# EAGLE design Adaptadores Seriales (EAGLE 6.1)
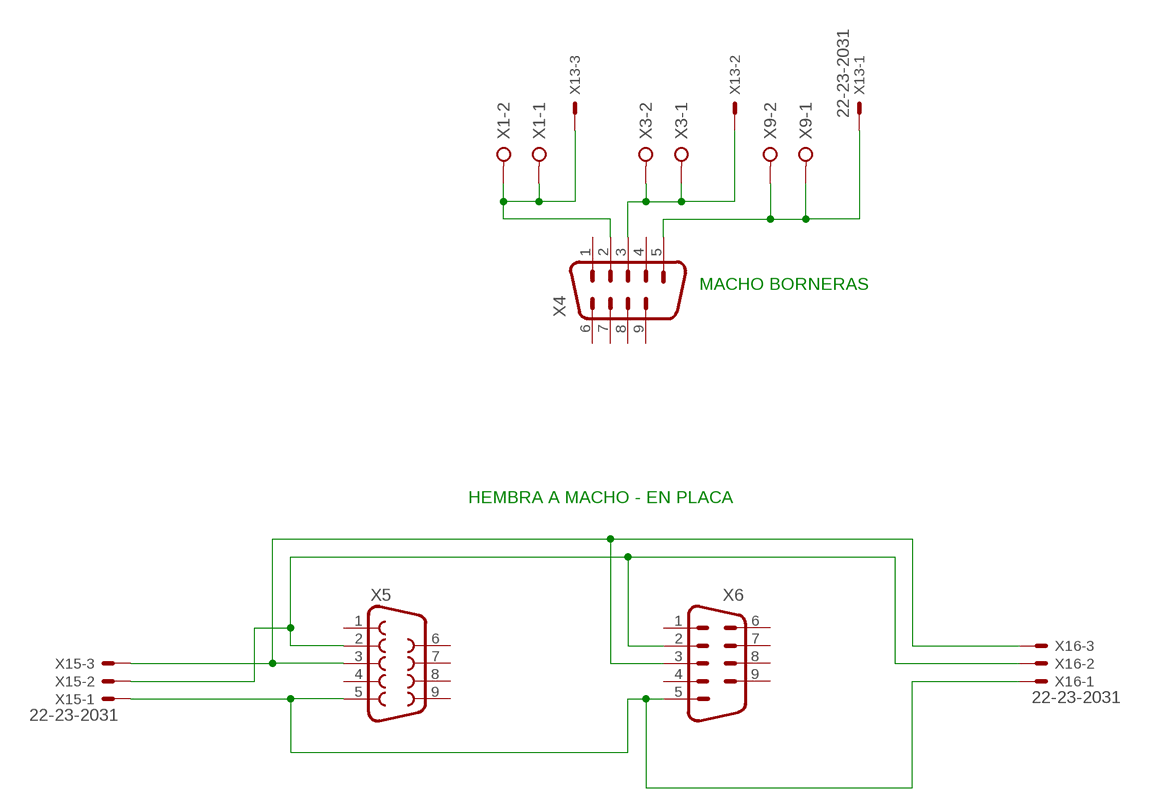
[diagram p0: schematic, sheet 1, part 1 of 2]
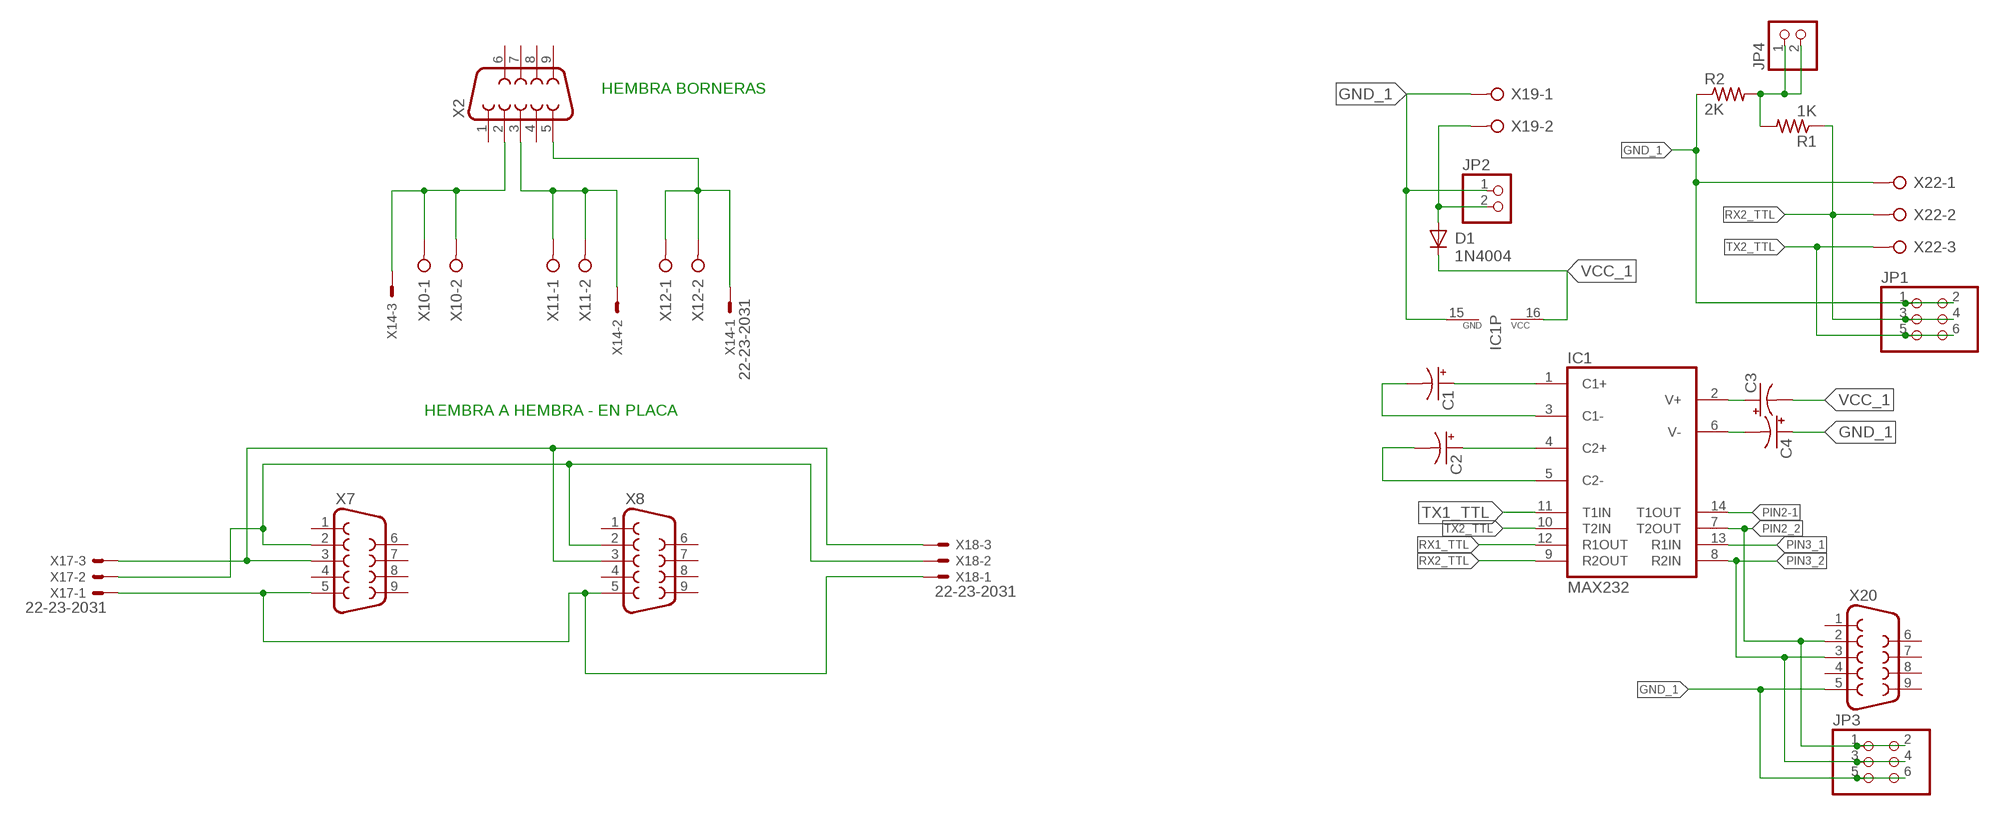
[diagram p1: schematic, sheet 1, part 2 of 2]

## Parts
C1  10UF-25V-20%(PTH)KIT  [CPOL-RADIAL-10UF-25V-KIT]
C2  10UF-25V-20%(PTH)KIT  [CPOL-RADIAL-10UF-25V-KIT]
C3  10UF-25V-20%(PTH)KIT  [CPOL-RADIAL-10UF-25V-KIT]
C4  10UF-25V-20%(PTH)KIT  [CPOL-RADIAL-10UF-25V-KIT]
D1  1N4004  [DO41-10]
IC1  MAX232  [DIL16]
JP1  PINHD-2X3  [2X03]
JP2  PINHD-1X2  [1X02]
JP3  PINHD-2X3  [2X03]
JP4  PINHD-1X2  [1X02]
R1  1K  R-US_0204/2V  [0204V]
R2  2K  R-US_0204/2V  [0204V]
X1  W237-02P  [W237-132]
X2  F09HP  [F09HP]
X3  W237-02P  [W237-132]
X4  M09HP  [M09HP]
X5  F09D  [F09D]
X6  M09D  [M09D]
X7  F09D  [F09D]
X8  F09D  [F09D]
X9  W237-02P  [W237-132]
X10  W237-02P  [W237-132]
X11  W237-02P  [W237-132]
X12  W237-02P  [W237-132]
X13  22-23-2031  [22-23-2031]
X14  22-23-2031  [22-23-2031]
X15  22-23-2031  [22-23-2031]
X16  22-23-2031  [22-23-2031]
X17  22-23-2031  [22-23-2031]
X18  22-23-2031  [22-23-2031]
X19  W237-02P  [W237-132]
X20  F09D  [F09D]
X22  W237-03P  [W237-133]

## Nets
GND_1: C4.1(+) IC1.15(GND) JP1.1 JP1.2 JP2.1 JP3.5 JP3.6 R2.1 X19.1 X20.5 X22.1
N$1: C1.1(+) IC1.1(C1+)
N$2: X5.2 X6.2 X15.2 X16.2
N$3: X5.3 X6.3 X15.3 X16.3
N$4: C1.2(-) IC1.3(C1-)
N$5: X5.5 X6.5 X15.1 X16.1
N$6: D1.A JP2.2 X19.2
N$7: C2.1(+) IC1.4(C2+)
N$8: C2.2(-) IC1.5(C2-)
N$9: C3.1(+) IC1.2(V+)
N$10: C4.2(-) IC1.6(V-)
N$11: X7.2 X8.2 X17.2 X18.2
N$12: X7.3 X8.3 X17.3 X18.3
N$13: JP4.1 JP4.2 R1.2 R2.2
N$14: X7.5 X8.5 X17.1 X18.1
N$19: X1.1 X1.2 X4.2 X13.3
N$21: X3.1 X3.2 X4.3 X13.2
N$22: X4.5 X9.1 X9.2 X13.1
N$23: X2.2 X10.1 X10.2 X14.3
N$24: X2.3 X11.1 X11.2 X14.2
N$25: X2.5 X12.1 X12.2 X14.1
PIN2-1: IC1.14(T1OUT)
PIN2_2: IC1.7(T2OUT) JP3.1 JP3.2 X20.2
PIN3_1: IC1.13(R1IN)
PIN3_2: IC1.8(R2IN) JP3.3 JP3.4 X20.3
RX1_TTL: IC1.12(R1OUT)
RX2_TTL: IC1.9(R2OUT) JP1.3 JP1.4 R1.1 X22.2
TX1_TTL: IC1.11(T1IN)
TX2_TTL: IC1.10(T2IN) JP1.5 JP1.6 X22.3
VCC_1: C3.2(-) D1.C IC1.16(VCC)
Unconnected: X2.1 X2.4 X2.6 X2.7 X2.8 X2.9 X4.1 X4.4 X4.6 X4.7 X4.8 X4.9 X5.1 X5.4 X5.6 X5.7 X5.8 X5.9 X6.1 X6.4 X6.6 X6.7 X6.8 X6.9 X7.1 X7.4 X7.6 X7.7 X7.8 X7.9 X8.1 X8.4 X8.6 X8.7 X8.8 X8.9 X20.1 X20.4 X20.6 X20.7 X20.8 X20.9

## Notes on the sheet
- HEMBRA BORNERAS
- MACHO BORNERAS
- HEMBRA A HEMBRA - EN PLACA
- HEMBRA A MACHO - EN PLACA

## Library data of the parts
C1-C4 = SparkFun-Capacitors:10UF-25V-20%(PTH): CAP-08440; PROD_ID: CAP-08440
D1 = diode:1N4004: DIODE general purpose rectifier, 1 A
IC1 = maxim:MAX232: RS232 TRANSEIVER; MF: MAXIM; MPN: MAX232ACPE+; OC_FARNELL: 9723773; OC_NEWARK: 68K4544
JP1 JP3 = pinhead:PINHD-2X3: PIN HEADER
JP2 JP4 = pinhead:PINHD-1X2: PIN HEADER
R1 R2 = rcl:R-US_: RESISTOR, American symbol
X1 X3 X9-X12 X19 = con-wago-508:W237-02P: WAGO SREW CLAMP; OC_FARNELL: unknown; OC_NEWARK: unknown
X2 X5 X7 X8 X20 = con-subd:F09: SUB-D; OC_FARNELL: unknown; OC_NEWARK: unknown
X4 X6 = con-subd:M09: SUB-D; OC_FARNELL: unknown; OC_NEWARK: unknown
X13-X18 = con-molex:22-23-2031: .100" (2.54mm) Center Header - 3 Pin; MF: MOLEX; MPN: 22-23-2031; OC_FARNELL: 1462950; OC_NEWARK: 30C0862
X22 = con-wago-508:W237-03P: WAGO SREW CLAMP; OC_FARNELL: unknown; OC_NEWARK: unknown

## Board
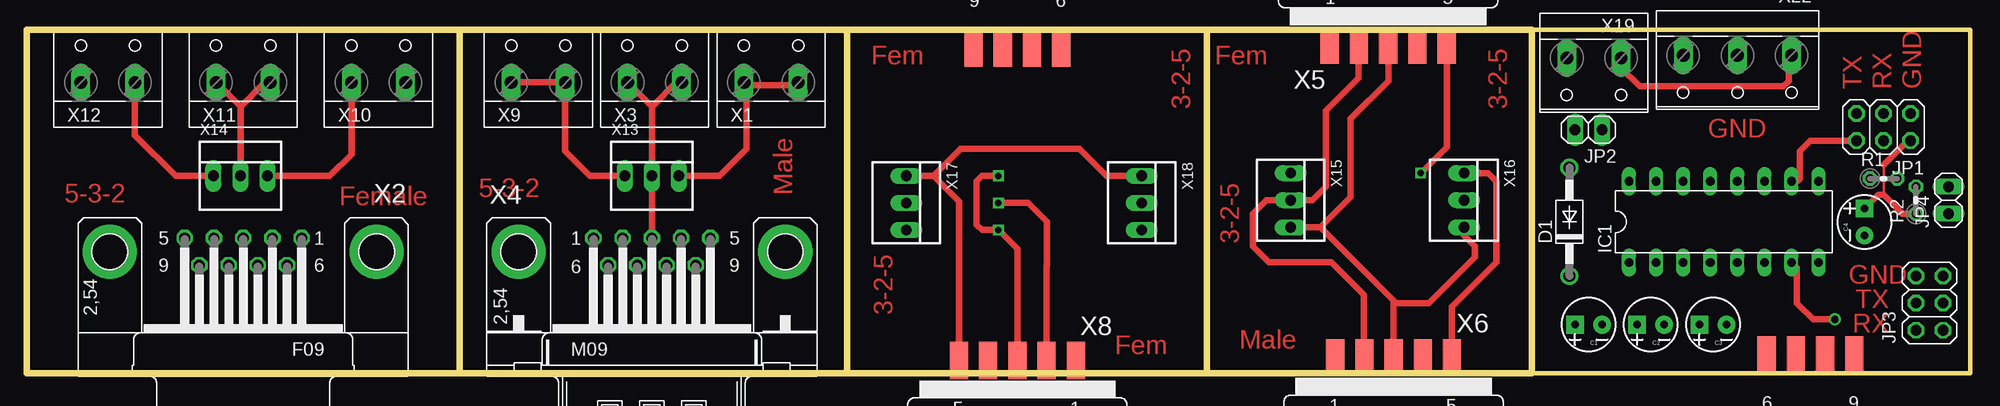
[diagram p2: board, top side]
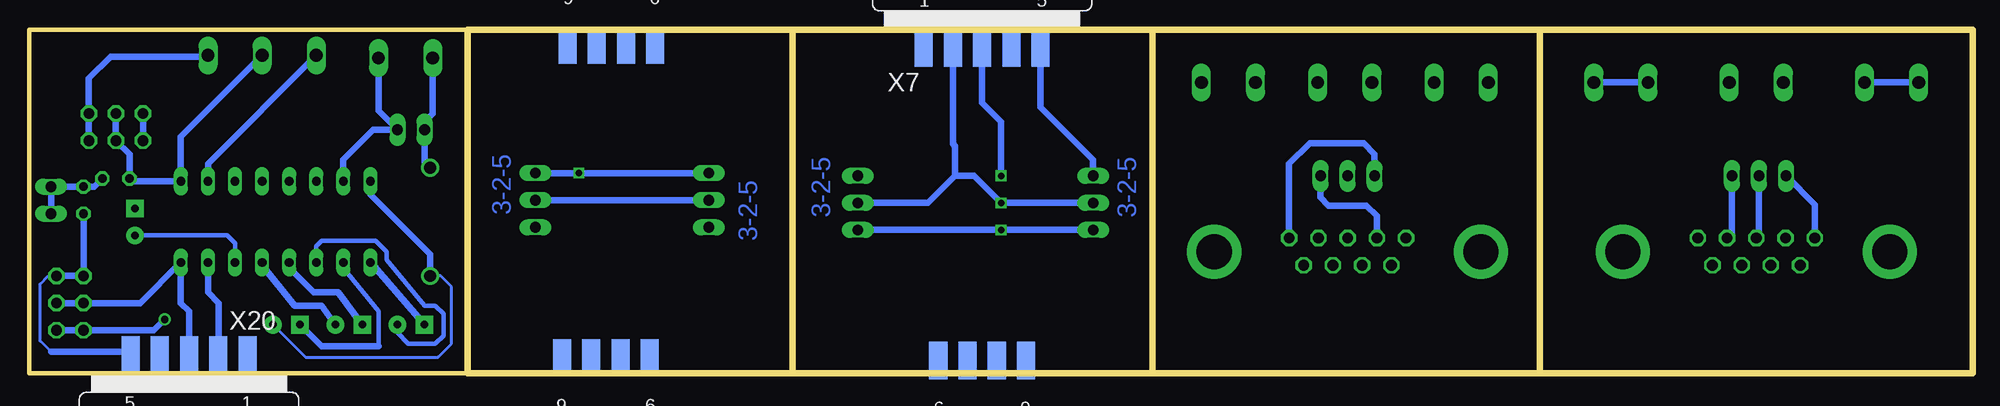
[diagram p3: board, bottom side, seen from below]

Size 182.37 x 32.26 mm. Coordinates in mm from the lower left corner, seen from the top.
Outline: 40.64,0 0,0 0,32.26 40.64,32.26
Outline: 40.64,0 76.96,0
Outline: 76.96,0 110.74,0
Outline: 110.74,0 141.22,0
Outline: 141.22,0 141.22,32.26
Outline: 141.22,32.26 110.74,32.26
Outline: 110.74,32.26 40.64,32.26
Outline: 40.64,32.26 40.64,0
Outline: 76.96,32 76.96,0
Outline: 110.74,32.26 110.74,0
Outline: 141.22,0 182.37,0 182.37,32.26 141.22,32.26
Copper layers (1*16): Top 0.035mm / dielectric 1.5mm / Bottom 0.035mm
Design rules: minimum track width 10mil, minimum drill 24mil, track to track 8mil, track to pad 8mil, pad to pad 8mil, via to via 8mil, smd to smd 8mil, copper to edge 40mil, drill to drill 8mil, minimum pad ring 10mil, minimum via ring 8mil, stop-mask expansion 4mil, vias tented up to drill 0mil, thermal gap 10mil

### Footprints (pad centres in the part's own frame; a part is rotated, then mirrored left to right if it is on the bottom)
CPOL-RADIAL-10UF-25V-KIT = drill 0.7 pad 1.651 square: 1 1.27,0 | drill 0.7 pad 1.651: 2 -1.27,0
DO41-10 = drill 1.118: A 5.08,0; C -5.08,0
DIL16 = drill 0.813 long: 1 -8.89,-3.81; 2 -6.35,-3.81; 3 -3.81,-3.81; 4 -1.27,-3.81; 5 1.27,-3.81; 6 3.81,-3.81; 7 6.35,-3.81; 8 8.89,-3.81; 9 8.89,3.81; 10 6.35,3.81; 11 3.81,3.81; 12 1.27,3.81; 13 -1.27,3.81; 14 -3.81,3.81; 15 -6.35,3.81; 16 -8.89,3.81
2X03 = drill 1.016 octagon: 1 -2.54,-1.27; 2 -2.54,1.27; 3 0,-1.27; 4 0,1.27; 5 2.54,-1.27; 6 2.54,1.27
1X02 = drill 1.016 long: 1 -1.27,0; 2 1.27,0
0204V = drill 0.813 octagon: 1 -1.27,0; 2 1.27,0
W237-132 = drill 1.194 long: 1 -2.54,-0.635; 2 2.54,-0.635
F09HP = drill 1.016 octagon: 1 -5.486,-1.27; 2 -2.743,-1.27; 3 0,-1.27; 4 2.743,-1.27; 5 5.486,-1.27; 6 -4.115,1.27; 7 -1.372,1.27; 8 1.372,1.27; 9 4.115,1.27 | drill 3.302 pad 5.08: G1 -12.522,0; G2 12.522,0
M09HP = drill 1.016 octagon: 1 -5.486,1.27; 2 -2.743,1.27; 3 0,1.27; 4 2.743,1.27; 5 5.486,1.27; 6 -4.115,-1.27; 7 -1.372,-1.27; 8 1.372,-1.27; 9 4.115,-1.27 | drill 3.302 pad 5.08: G1 -12.522,0; G2 12.522,0
F09D = smd 1.7 x 3.5: 1 -5.486,-6.045; 2 -2.743,-6.045; 3 0,-6.045; 4 2.743,-6.045; 5 5.486,-6.045 | smd 1.7 x 3.5 bottom: 6 -4.115,-6.045; 7 -1.372,-6.045; 8 1.372,-6.045; 9 4.115,-6.045
M09D = smd 1.7 x 3.5: 1 5.486,-6.045; 2 2.743,-6.045; 3 0,-6.045; 4 -2.743,-6.045; 5 -5.486,-6.045 | smd 1.7 x 3.5 bottom: 6 4.115,-6.045; 7 1.372,-6.045; 8 -1.372,-6.045; 9 -4.115,-6.045
22-23-2031 = drill 1 long: 1 -2.54,0; 2 0,0; 3 2.54,0
W237-133 = drill 1.194 long: 1 -5.08,-0.635; 2 0,-0.635; 3 5.08,-0.635

### Placement (x,y rotation side)
C1  146.56,4.57 180 top
C2  152.4,4.57 180 top
C3  158.24,4.57 180 top
C4  172.47,14.22 90 top
D1  144.78,14.22 90 top
IC1  159.26,14.22 0 top
JP1  174.24,23.11 180 top
JP2  146.56,22.86 180 top
JP3  178.56,6.6 90 top
JP4  180.34,16.26 90 top
R1  174.24,18.29 0 top
R2  177.29,16.26 90 top
X1  69.85,27.94 0 top
X2  20.32,11.43 180 top
X3  58.93,27.94 0 top
X4  58.67,11.43 0 top
X5  127.76,36.83 0 top
X6  128.27,-4.57 180 top
X7  92.96,36.58 0 bottom
X8  92.96,-4.83 180 top
X9  48.01,27.94 0 top
X10  33.02,27.94 0 top
X11  20.32,27.94 0 top
X12  7.62,27.94 0 top
X13  58.67,18.54 0 top
X14  20.07,18.54 0 top
X15  118.62,16.26 270 top
X16  134.87,16.26 270 top
X17  82.55,16 270 top
X18  104.65,16 270 top
X19  147.07,28.96 180 top
X20  167.39,-4.32 180 bottom
X22  160.53,29.21 180 top

### Tracks (layer width: path | path; a pad name or v marks a point on that pad's centre or on a via)
GND_1
  Top 0.254: 174.24,19.56 174.24,16.76
  Top 0.61: X19.1 149.61,28.7 151.38,26.92 164.85,26.92 165.35,27.43 165.35,29.59 X22.1 | JP1.2 176.53,21.84 174.24,19.56 | C4.1 173.74,16.76 174.24,16.76 176.02,14.99 R2.1
  Bottom 0.305: 180.34,2.03 181.36,3.05 181.36,8.38 180.59,9.14 JP3.5
  Bottom 0.61: X19.1 149.61,24.64 JP2.1 150.11,22.86 152.91,20.07 IC1.15 | X20.5 173.18,2.03 180.34,2.03 | R2.1 JP3.6 JP3.5 | JP1.2 JP1.1 176.78,27.69 174.75,29.72 165.74,29.72 X22.1
N$1
  Bottom 0.61: C1.1 IC1.1
N$2
  Top 0.61: X5.2 124.97,30.73 124.97,27.69 121.92,24.64 121.92,17.53 120.65,16.26 X15.2 116.33,16.26 115.06,14.99 115.06,11.94 116.59,10.41 122.43,10.41 125.48,7.37 125.48,1.52 X6.2
  Bottom 0.61: X16.2 X15.2
N$3
  Top 0.61: X5.3 127.76,27.43 124.21,23.88 124.21,16.51 121.41,13.72 | X6.3 128.27,6.86 | 128.27,6.86 121.41,13.72 | 128.27,6.86 128.52,6.6 131.57,6.6 135.89,10.92 135.89,11.94 134.87,12.95 X16.3 134.87,13.46 | 121.41,13.72 X15.3
N$4
  Bottom 0.406: IC1.3 155.45,11.94 154.94,12.45 149.86,12.45 148.84,11.43 148.84,10.67 145.29,6.35 144.27,6.35 143.51,5.59 143.51,3.56 144.27,2.79 146.81,2.79 147.83,3.81 C1.2
N$5  (via drill 0.6)
  Top 0.61: X5.5 133.25,21.23 v130.81,18.8 | X6.5 133.76,6.25 137.92,10.41 137.92,18.03 137.16,18.8 X16.1
  Bottom 0.61: X15.1 v130.81,18.8 X16.1
N$6
  Bottom 0.61: X19.2 144.53,24.38 145.29,23.62 JP2.2 145.29,19.81 D1.A
N$7
  Bottom 0.61: C2.1 153.42,7.62 155.7,7.62 157.99,9.91 IC1.4
N$8
  Bottom 0.61: C2.2 154.94,6.35 157.48,6.35 160.53,10.16 IC1.5
N$9
  Bottom 0.406: 149.61,2.54 149.61,5.84 152.91,9.91 IC1.2
  Bottom 0.61: C3.1 154.94,2.54 149.61,2.54
N$10
  Bottom 0.406: IC1.6 163.07,12.19 163.83,12.95 C4.2
N$11  (via drill 0.6)
  Top 0.61: v91.19,16 93.98,16 95.76,14.22 95.76,10.16 95.71,10.11 X8.2
  Bottom 0.61: 95.5,18.54 95.5,21.34 95.71,21.54 X7.2 | 95.5,18.54 98.04,16 X18.2 | 95.5,18.54 93.73,18.54 v91.19,16 X17.2
N$12  (via drill 0.6)
  Top 0.61: X8.3 92.96,11.68 v91.19,13.46 89.66,13.46 89.15,13.97 89.15,18.03 89.66,18.54 v91.19,18.54
  Bottom 0.61: v91.19,18.54 91.19,23.62 92.96,25.4 X7.3 | X18.3 v91.19,13.46 X17.3
N$13
  Bottom 0.61: JP4.1 JP4.2 R2.2 176.28,17.53 R1.2
N$14
  Top 0.61: X8.5 87.48,16.15 85.09,18.54 | 85.09,18.54 87.63,21.08 98.81,21.08 101.35,18.54 X18.1 | 85.09,18.54 X17.1
  Bottom 0.61: X7.5 87.48,24.99 82.55,20.07 X17.1
N$19
  Top 0.61: X13.3 65.02,18.54 67.56,21.08 67.56,27.05 | 67.56,27.05 X1.1 | 67.56,27.05 72.14,27.05 X1.2
  Bottom 0.61: X4.2 55.93,14.78 56.9,15.75 60.45,15.75 61.21,16.51 X13.3
N$21
  Top 0.61: X4.3 X13.2 58.67,25.02 | 58.67,25.02 X3.1 | X3.2 60.96,27.3 58.67,25.02
N$22
  Top 0.61: X13.1 52.83,18.54 50.55,20.83 X9.2 X9.1
  Bottom 0.61: X4.5 64.16,19.66 62.23,21.59 57.15,21.59 56.13,20.57 X13.1
N$23
  Top 0.61: X14.3 28.45,18.54 30.48,20.57 X10.1
  Bottom 0.61: X14.3 22.61,13.16 X2.2 | X10.2 X10.1
N$24
  Top 0.61: X14.2 20.07,25.02 | 20.07,25.02 X11.1 | X11.2 22.35,27.3 20.07,25.02
  Bottom 0.61: X14.2 20.07,12.95 X2.3
N$25
  Top 0.61: X14.1 13.97,18.54 10.16,22.35 X12.2
  Bottom 0.61: X2.5 14.83,15.85 X14.1 | X12.2 X12.1
PIN2_2  (via drill 0.7)
  Top 0.61: v169.67,5.08 167.64,5.08 166.12,6.6 166.12,9.91 IC1.7
  Bottom 0.61: X20.2 164.59,1.78 164.59,6.6 165.61,7.62 IC1.7 | JP3.1 JP3.2 170.69,4.06 v169.67,5.08
PIN3_2
  Bottom 0.61: X20.3 167.39,5.84 168.15,6.6 IC1.8 171.96,6.6 JP3.4 JP3.3
RX2_TTL
  Bottom 0.61: X22.2 168.15,22.23 IC1.9 172.72,18.03 R1.1 172.97,20.57 JP1.4 JP1.3
TX2_TTL
  Top 0.61: JP1.6 167.39,21.84 166.37,20.83 166.37,18.29 166.12,18.03 IC1.10
  Bottom 0.61: X22.3 165.61,19.68 IC1.10 | JP1.6 JP1.5
VCC_1
  Bottom 0.305: C3.2 156.46,1.52 144.02,1.52 142.75,2.79 142.75,8.13 143.76,9.14 D1.C
  Bottom 0.61: D1.C 144.78,11.18 150.37,16.76 IC1.16

### Text on the board
Top: 3-2-5 | 3-2-5 | Fem | Fem | TX | RX | GND | Male | GND | Female | 5-3-2 | 5-3-2 | 3-2-5 | 3-2-5 | GND | TX | RX | Fem | Male
Bottom: 3-2-5 | 3-2-5 | 3-2-5 | 3-2-5